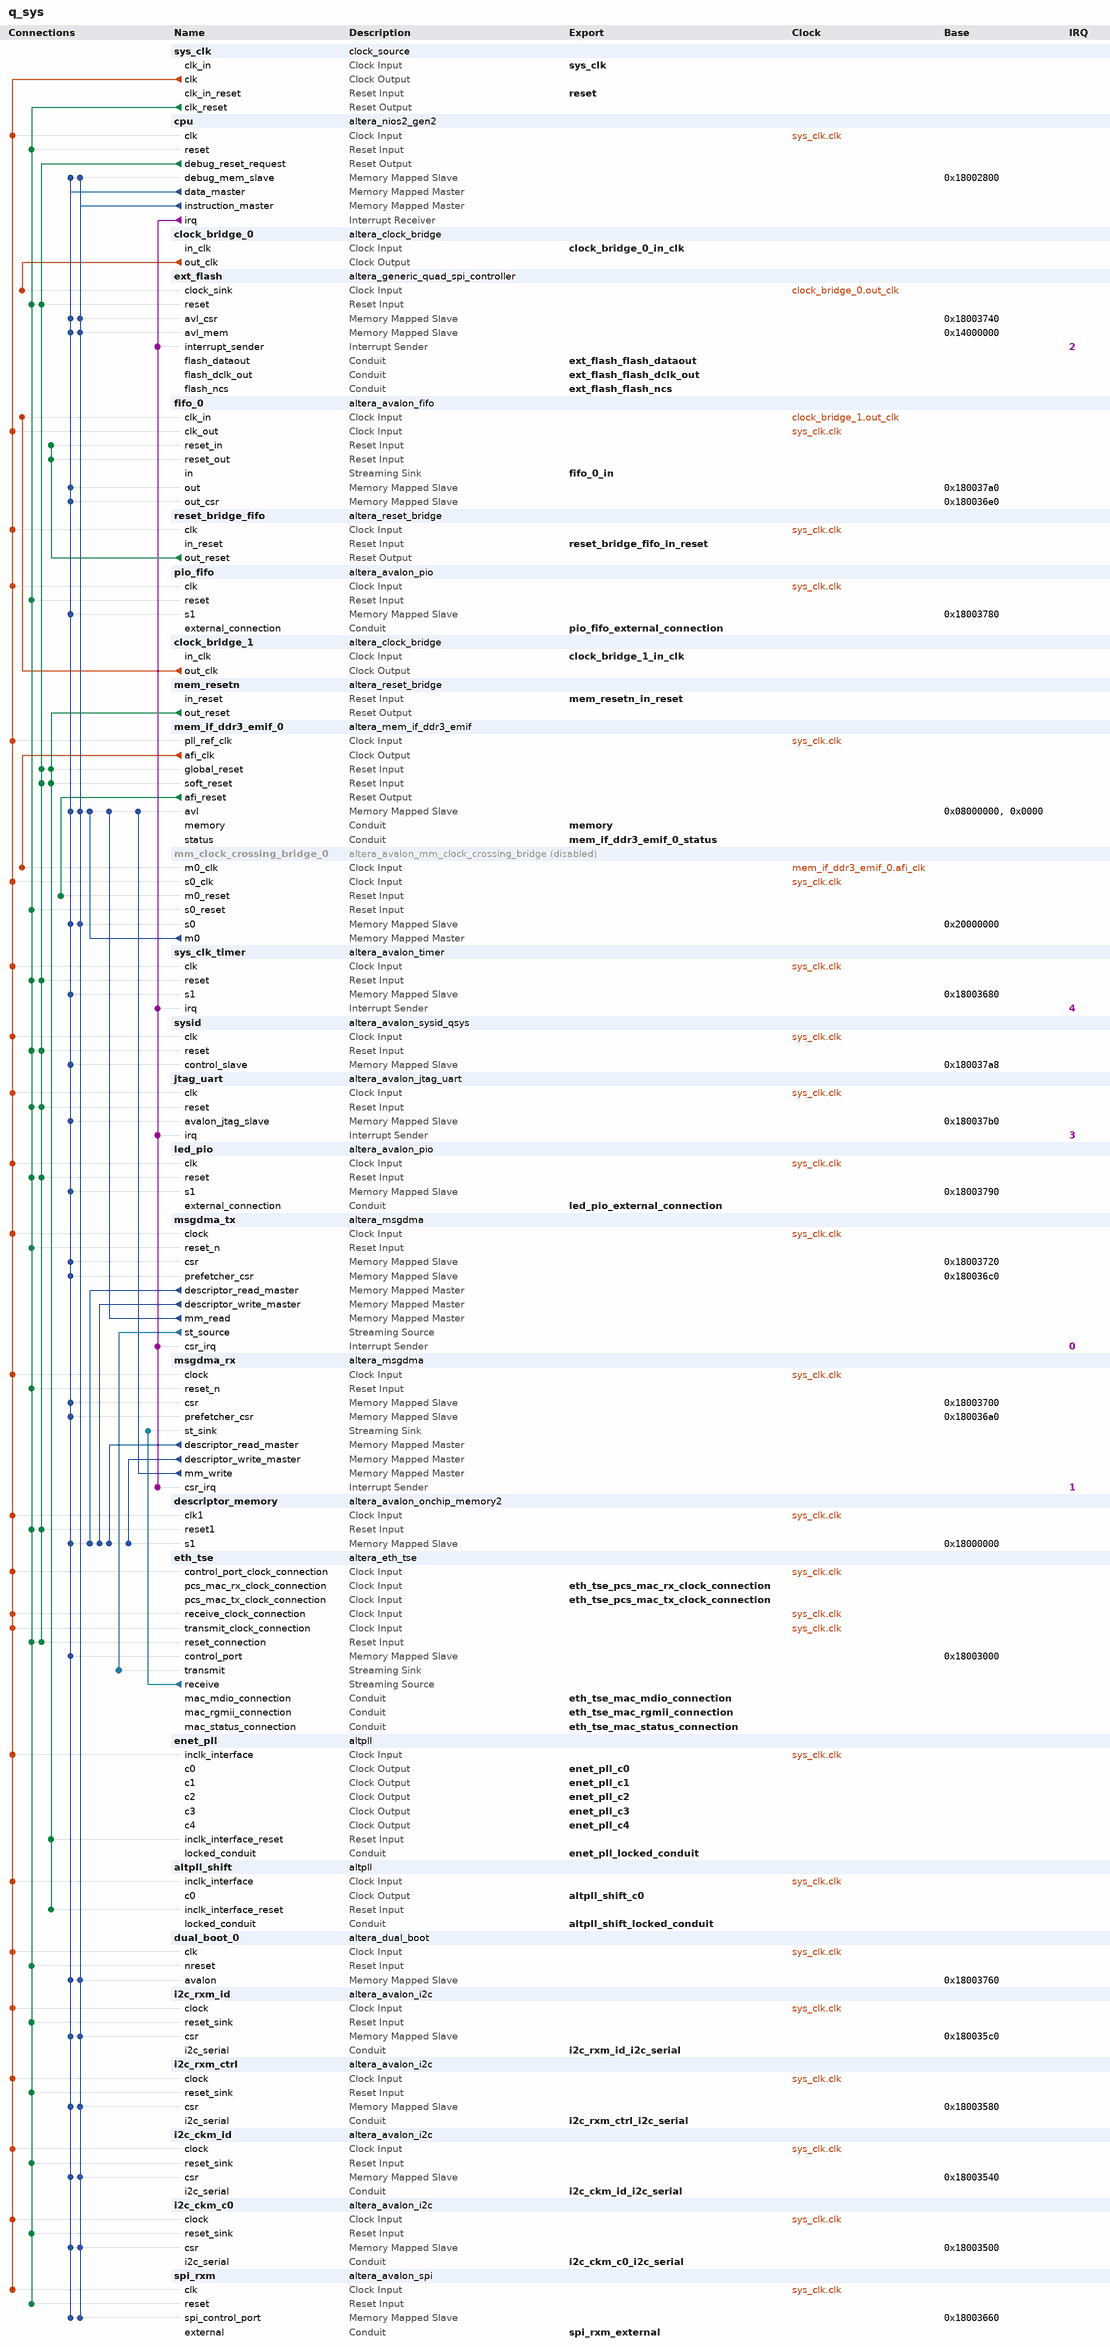
[diagram p0: system contents]
# Platform Designer (Qsys) system q_sys, MAX 10 10M50DAF484C6GES
# Parameters at their usual value, and those the tool derives, are not listed.
package require -exact qsys 20.1
create_system q_sys
set_project_property DEVICE_FAMILY {MAX 10}
set_project_property DEVICE 10M50DAF484C6GES

add_instance sys_clk clock_source 20.1
set_instance_parameter_value sys_clk clockFrequency 50000000

add_instance cpu altera_nios2_gen2 20.1
set_instance_parameter_value cpu dcache_size 0
set_instance_parameter_value cpu exceptionOffset 288
set_instance_parameter_value cpu exceptionSlave mem_if_ddr3_emif_0.avl
set_instance_parameter_value cpu icache_size 0
set_instance_parameter_value cpu impl Fast
set_instance_parameter_value cpu mul_32_impl 3
set_instance_parameter_value cpu resetOffset 4390912
set_instance_parameter_value cpu resetSlave ext_flash.avl_mem
set_instance_parameter_value cpu setting_activateTrace true
set_instance_parameter_value cpu shift_rot_impl 0

add_instance clock_bridge_0 altera_clock_bridge 20.1
set_instance_parameter_value clock_bridge_0 DERIVED_CLOCK_RATE 0
set_instance_parameter_value clock_bridge_0 EXPLICIT_CLOCK_RATE 0

add_instance ext_flash altera_generic_quad_spi_controller 20.1
set_instance_parameter_value ext_flash CHIP_SELS 1
set_instance_parameter_value ext_flash FLASH_TYPE Micron512
set_instance_parameter_value ext_flash IO_MODE QUAD
set_instance_parameter_value ext_flash UNIQUE_ID {$${FILENAME}_ext_flash}
set_instance_parameter_value ext_flash clkFreq 0

add_instance fifo_0 altera_avalon_fifo 20.1
set_instance_parameter_value fifo_0 bitsPerSymbol 32
set_instance_parameter_value fifo_0 channelWidth 0
set_instance_parameter_value fifo_0 errorWidth 0
set_instance_parameter_value fifo_0 fifoDepth 8192
set_instance_parameter_value fifo_0 fifoInputInterfaceOptions AVALONST_SINK
set_instance_parameter_value fifo_0 fifoOutputInterfaceOptions AVALONMM_READ
set_instance_parameter_value fifo_0 singleClockMode false
set_instance_parameter_value fifo_0 symbolsPerBeat 1
set_instance_parameter_value fifo_0 useIRQ true
set_instance_parameter_value fifo_0 usePacket false
set_instance_parameter_value fifo_0 useReadControl true
set_instance_parameter_value fifo_0 useWriteControl false

add_instance reset_bridge_fifo altera_reset_bridge 20.1
set_instance_parameter_value reset_bridge_fifo ACTIVE_LOW_RESET 0
set_instance_parameter_value reset_bridge_fifo SYNCHRONOUS_EDGES deassert

add_instance pio_fifo altera_avalon_pio 20.1
set_instance_parameter_value pio_fifo direction Output
set_instance_parameter_value pio_fifo width 1

add_instance clock_bridge_1 altera_clock_bridge 20.1
set_instance_parameter_value clock_bridge_1 DERIVED_CLOCK_RATE 0
set_instance_parameter_value clock_bridge_1 EXPLICIT_CLOCK_RATE 0

add_instance mem_resetn altera_reset_bridge 20.1
set_instance_parameter_value mem_resetn ACTIVE_LOW_RESET 1
set_instance_parameter_value mem_resetn SYNCHRONOUS_EDGES none

add_instance mem_if_ddr3_emif_0 altera_mem_if_ddr3_emif 20.1
set_instance_parameter_value mem_if_ddr3_emif_0 AVL_MAX_SIZE 4
set_instance_parameter_value mem_if_ddr3_emif_0 CALIBRATION_MODE Skip
set_instance_parameter_value mem_if_ddr3_emif_0 CPORT_TYPE_PORT Bidirectional,Bidirectional,Bidirectional,Bidirectional,Bidirectional,Bidirectional
set_instance_parameter_value mem_if_ddr3_emif_0 EXPORT_AFI_HALF_CLK false
set_instance_parameter_value mem_if_ddr3_emif_0 HARD_EMIF false
set_instance_parameter_value mem_if_ddr3_emif_0 MEM_BANKADDR_WIDTH 3
set_instance_parameter_value mem_if_ddr3_emif_0 MEM_CLK_FREQ 300.0
set_instance_parameter_value mem_if_ddr3_emif_0 MEM_CLK_FREQ_MAX 800.0
set_instance_parameter_value mem_if_ddr3_emif_0 MEM_COL_ADDR_WIDTH 10
set_instance_parameter_value mem_if_ddr3_emif_0 MEM_DQ_WIDTH 8
set_instance_parameter_value mem_if_ddr3_emif_0 MEM_DRV_STR RZQ/6
set_instance_parameter_value mem_if_ddr3_emif_0 MEM_FORMAT DISCRETE
set_instance_parameter_value mem_if_ddr3_emif_0 MEM_ROW_ADDR_WIDTH 14
set_instance_parameter_value mem_if_ddr3_emif_0 MEM_RTT_NOM {ODT Disabled}
set_instance_parameter_value mem_if_ddr3_emif_0 MEM_RTT_WR {Dynamic ODT off}
set_instance_parameter_value mem_if_ddr3_emif_0 MEM_TCL 5
set_instance_parameter_value mem_if_ddr3_emif_0 MEM_TFAW_NS 30.0
set_instance_parameter_value mem_if_ddr3_emif_0 MEM_TRAS_NS 35.0
set_instance_parameter_value mem_if_ddr3_emif_0 MEM_TRCD_NS 13.75
set_instance_parameter_value mem_if_ddr3_emif_0 MEM_TRFC_NS 110.0
set_instance_parameter_value mem_if_ddr3_emif_0 MEM_TRP_NS 13.75
set_instance_parameter_value mem_if_ddr3_emif_0 MEM_TRRD_NS 6.0
set_instance_parameter_value mem_if_ddr3_emif_0 MEM_TRTP_NS 7.5
set_instance_parameter_value mem_if_ddr3_emif_0 MEM_TWTR 6
set_instance_parameter_value mem_if_ddr3_emif_0 MEM_VENDOR JEDEC
set_instance_parameter_value mem_if_ddr3_emif_0 MEM_WTCL 5
set_instance_parameter_value mem_if_ddr3_emif_0 PLL_LOCATION Top_Bottom
set_instance_parameter_value mem_if_ddr3_emif_0 POWER_OF_TWO_BUS false
set_instance_parameter_value mem_if_ddr3_emif_0 PRIORITY_PORT 1,1,1,1,1,1
set_instance_parameter_value mem_if_ddr3_emif_0 RATE Half
set_instance_parameter_value mem_if_ddr3_emif_0 REF_CLK_FREQ 50.0
set_instance_parameter_value mem_if_ddr3_emif_0 SPEED_GRADE 6
set_instance_parameter_value mem_if_ddr3_emif_0 TIMING_BOARD_AC_SKEW 0.07801
set_instance_parameter_value mem_if_ddr3_emif_0 TIMING_BOARD_AC_TO_CK_SKEW -0.04709
set_instance_parameter_value mem_if_ddr3_emif_0 TIMING_BOARD_DQ_TO_DQS_SKEW -0.01152
set_instance_parameter_value mem_if_ddr3_emif_0 TIMING_BOARD_MAX_CK_DELAY 0.2443
set_instance_parameter_value mem_if_ddr3_emif_0 TIMING_BOARD_MAX_DQS_DELAY 0.21929
set_instance_parameter_value mem_if_ddr3_emif_0 TIMING_BOARD_SKEW_BETWEEN_DQS 0.04246
set_instance_parameter_value mem_if_ddr3_emif_0 TIMING_BOARD_SKEW_CKDQS_DIMM_MAX 0.04429
set_instance_parameter_value mem_if_ddr3_emif_0 TIMING_BOARD_SKEW_CKDQS_DIMM_MIN 0.02286
set_instance_parameter_value mem_if_ddr3_emif_0 TIMING_BOARD_SKEW_WITHIN_DQS 0.01806
set_instance_parameter_value mem_if_ddr3_emif_0 TIMING_TDH 45
set_instance_parameter_value mem_if_ddr3_emif_0 TIMING_TDQSCK 225
set_instance_parameter_value mem_if_ddr3_emif_0 TIMING_TDQSQ 100
set_instance_parameter_value mem_if_ddr3_emif_0 TIMING_TDQSS 0.27
set_instance_parameter_value mem_if_ddr3_emif_0 TIMING_TDS 10
set_instance_parameter_value mem_if_ddr3_emif_0 TIMING_TDSH 0.18
set_instance_parameter_value mem_if_ddr3_emif_0 TIMING_TDSS 0.18
set_instance_parameter_value mem_if_ddr3_emif_0 TIMING_TIH 120
set_instance_parameter_value mem_if_ddr3_emif_0 TIMING_TIS 170
set_instance_parameter_value mem_if_ddr3_emif_0 TIMING_TQSH 0.4
set_instance_parameter_value mem_if_ddr3_emif_0 USER_DEBUG_LEVEL 1

add_instance mm_clock_crossing_bridge_0 altera_avalon_mm_clock_crossing_bridge 20.1
set_instance_property mm_clock_crossing_bridge_0 ENABLED false
set_instance_parameter_value mm_clock_crossing_bridge_0 ADDRESS_WIDTH 27
set_instance_parameter_value mm_clock_crossing_bridge_0 COMMAND_FIFO_DEPTH 4
set_instance_parameter_value mm_clock_crossing_bridge_0 DATA_WIDTH 32
set_instance_parameter_value mm_clock_crossing_bridge_0 MASTER_SYNC_DEPTH 2
set_instance_parameter_value mm_clock_crossing_bridge_0 MAX_BURST_SIZE 1
set_instance_parameter_value mm_clock_crossing_bridge_0 RESPONSE_FIFO_DEPTH 4
set_instance_parameter_value mm_clock_crossing_bridge_0 SLAVE_SYNC_DEPTH 2
set_instance_parameter_value mm_clock_crossing_bridge_0 USE_AUTO_ADDRESS_WIDTH 0

add_instance sys_clk_timer altera_avalon_timer 20.1
set_instance_parameter_value sys_clk_timer period 10
set_instance_parameter_value sys_clk_timer periodUnits MSEC

add_instance sysid altera_avalon_sysid_qsys 20.1
set_instance_parameter_value sysid id -87110914

add_instance jtag_uart altera_avalon_jtag_uart 20.1
set_instance_parameter_value jtag_uart simInteractiveOptions INTERACTIVE_ASCII_OUTPUT

add_instance led_pio altera_avalon_pio 20.1
set_instance_parameter_value led_pio direction Output
set_instance_parameter_value led_pio resetValue 15
set_instance_parameter_value led_pio width 4

add_instance msgdma_tx altera_msgdma 20.1
set_instance_parameter_value msgdma_tx BURST_ENABLE 0
set_instance_parameter_value msgdma_tx DATA_FIFO_DEPTH 32
set_instance_parameter_value msgdma_tx DATA_WIDTH 32
set_instance_parameter_value msgdma_tx DESCRIPTOR_FIFO_DEPTH 128
set_instance_parameter_value msgdma_tx ENHANCED_FEATURES 0
set_instance_parameter_value msgdma_tx ERROR_ENABLE 1
set_instance_parameter_value msgdma_tx MAX_BURST_COUNT 2
set_instance_parameter_value msgdma_tx MAX_BYTE 2048
set_instance_parameter_value msgdma_tx MODE 1
set_instance_parameter_value msgdma_tx PACKET_ENABLE 1
set_instance_parameter_value msgdma_tx PREFETCHER_ENABLE 1
set_instance_parameter_value msgdma_tx TRANSFER_TYPE {Aligned Accesses}

add_instance msgdma_rx altera_msgdma 20.1
set_instance_parameter_value msgdma_rx BURST_ENABLE 0
set_instance_parameter_value msgdma_rx DATA_FIFO_DEPTH 32
set_instance_parameter_value msgdma_rx DATA_WIDTH 32
set_instance_parameter_value msgdma_rx DESCRIPTOR_FIFO_DEPTH 128
set_instance_parameter_value msgdma_rx ENHANCED_FEATURES 0
set_instance_parameter_value msgdma_rx ERROR_ENABLE 1
set_instance_parameter_value msgdma_rx MAX_BURST_COUNT 2
set_instance_parameter_value msgdma_rx MAX_BYTE 2048
set_instance_parameter_value msgdma_rx MODE 2
set_instance_parameter_value msgdma_rx PACKET_ENABLE 1
set_instance_parameter_value msgdma_rx PREFETCHER_ENABLE 1
set_instance_parameter_value msgdma_rx TRANSFER_TYPE {Aligned Accesses}

add_instance descriptor_memory altera_avalon_onchip_memory2 20.1
set_instance_parameter_value descriptor_memory dataWidth 32
set_instance_parameter_value descriptor_memory dualPort false
set_instance_parameter_value descriptor_memory initMemContent true
set_instance_parameter_value descriptor_memory initializationFileName /home/tom/Eth-TSDR-03/devkit_simple_socket_server-17_project/q_sys_descriptor_memory.hex
set_instance_parameter_value descriptor_memory memorySize 8192

add_instance eth_tse altera_eth_tse 20.1
set_instance_parameter_value eth_tse XCVR_RCFG_JTAG_ENABLE 0
set_instance_parameter_value eth_tse XCVR_SET_CAPABILITY_REG_ENABLE 0
set_instance_parameter_value eth_tse XCVR_SET_CSR_SOFT_LOGIC_ENABLE 0
set_instance_parameter_value eth_tse XCVR_SET_PRBS_SOFT_LOGIC_ENABLE 0
set_instance_parameter_value eth_tse XCVR_SET_USER_IDENTIFIER 0
set_instance_parameter_value eth_tse core_variation MAC_ONLY
set_instance_parameter_value eth_tse enable_hd_logic false
set_instance_parameter_value eth_tse enable_mac_flow_ctrl false
set_instance_parameter_value eth_tse enable_magic_detect true
set_instance_parameter_value eth_tse enable_sgmii true
set_instance_parameter_value eth_tse enable_shift16 true
set_instance_parameter_value eth_tse ifGMII RGMII
set_instance_parameter_value eth_tse ing_addr 11
set_instance_parameter_value eth_tse mdio_clk_div 40
set_instance_parameter_value eth_tse nf_phyip_rcfg_enable true
set_instance_parameter_value eth_tse stat_cnt_ena true
set_instance_parameter_value eth_tse transceiver_type NONE

add_instance enet_pll altpll 20.1
set_instance_parameter_value enet_pll CLK0_DIVIDE_BY 2
set_instance_parameter_value enet_pll CLK0_MULTIPLY_BY 5
set_instance_parameter_value enet_pll CLK1_DIVIDE_BY 2
set_instance_parameter_value enet_pll CLK1_DUTY_CYCLE 50
set_instance_parameter_value enet_pll CLK1_MULTIPLY_BY 1
set_instance_parameter_value enet_pll CLK1_PHASE_SHIFT 0
set_instance_parameter_value enet_pll CLK2_DIVIDE_BY 20
set_instance_parameter_value enet_pll CLK2_DUTY_CYCLE 50
set_instance_parameter_value enet_pll CLK2_MULTIPLY_BY 1
set_instance_parameter_value enet_pll CLK2_PHASE_SHIFT 0
set_instance_parameter_value enet_pll CLK3_DIVIDE_BY 2
set_instance_parameter_value enet_pll CLK3_DUTY_CYCLE 50
set_instance_parameter_value enet_pll CLK3_MULTIPLY_BY 5
set_instance_parameter_value enet_pll CLK3_PHASE_SHIFT -3000
set_instance_parameter_value enet_pll CLK4_DIVIDE_BY 2
set_instance_parameter_value enet_pll CLK4_DUTY_CYCLE 50
set_instance_parameter_value enet_pll CLK4_MULTIPLY_BY 1
set_instance_parameter_value enet_pll CLK4_PHASE_SHIFT -10000
set_instance_parameter_value enet_pll INCLK0_INPUT_FREQUENCY 20000
set_instance_parameter_value enet_pll OPERATION_MODE NO_COMPENSATION
set_instance_parameter_value enet_pll PORT_ARESET PORT_UNUSED
set_instance_parameter_value enet_pll PORT_LOCKED PORT_USED
set_instance_parameter_value enet_pll PORT_clk1 PORT_USED
set_instance_parameter_value enet_pll PORT_clk2 PORT_USED
set_instance_parameter_value enet_pll PORT_clk3 PORT_USED
set_instance_parameter_value enet_pll PORT_clk4 PORT_USED

add_instance altpll_shift altpll 20.1
set_instance_parameter_value altpll_shift CLK0_DIVIDE_BY 1
set_instance_parameter_value altpll_shift CLK0_MULTIPLY_BY 5
set_instance_parameter_value altpll_shift CLK1_DIVIDE_BY 2
set_instance_parameter_value altpll_shift CLK1_DUTY_CYCLE 50
set_instance_parameter_value altpll_shift CLK1_MULTIPLY_BY 1
set_instance_parameter_value altpll_shift CLK1_PHASE_SHIFT 15000
set_instance_parameter_value altpll_shift CLK2_DIVIDE_BY 20
set_instance_parameter_value altpll_shift CLK2_DUTY_CYCLE 50
set_instance_parameter_value altpll_shift CLK2_MULTIPLY_BY 1
set_instance_parameter_value altpll_shift CLK2_PHASE_SHIFT 0
set_instance_parameter_value altpll_shift INCLK0_INPUT_FREQUENCY 20000
set_instance_parameter_value altpll_shift PORT_ARESET PORT_USED
set_instance_parameter_value altpll_shift PORT_LOCKED PORT_USED
set_instance_parameter_value altpll_shift PORT_clk1 PORT_UNUSED
set_instance_parameter_value altpll_shift PORT_clk2 PORT_UNUSED
set_instance_parameter_value altpll_shift PORT_clk3 PORT_UNUSED

add_instance dual_boot_0 altera_dual_boot 20.1
set_instance_parameter_value dual_boot_0 CLOCK_FREQUENCY 50.0

add_instance i2c_rxm_id altera_avalon_i2c 20.1
set_instance_parameter_value i2c_rxm_id FIFO_DEPTH 4

add_instance i2c_rxm_ctrl altera_avalon_i2c 20.1
set_instance_parameter_value i2c_rxm_ctrl FIFO_DEPTH 4

add_instance i2c_ckm_id altera_avalon_i2c 20.1
set_instance_parameter_value i2c_ckm_id FIFO_DEPTH 4

add_instance i2c_ckm_c0 altera_avalon_i2c 20.1
set_instance_parameter_value i2c_ckm_c0 FIFO_DEPTH 4

add_instance spi_rxm altera_avalon_spi 20.1
set_instance_parameter_value spi_rxm clockPolarity 0
set_instance_parameter_value spi_rxm dataWidth 8
set_instance_parameter_value spi_rxm masterSPI true
set_instance_parameter_value spi_rxm numberOfSlaves 1
set_instance_parameter_value spi_rxm targetClockRate 6250000

# connections
add_connection clock_bridge_0.out_clk ext_flash.clock_sink clock
add_connection clock_bridge_1.out_clk fifo_0.clk_in clock
add_connection mem_if_ddr3_emif_0.afi_clk mm_clock_crossing_bridge_0.m0_clk clock
add_connection sys_clk.clk altpll_shift.inclk_interface clock
add_connection sys_clk.clk cpu.clk clock
add_connection sys_clk.clk descriptor_memory.clk1 clock
add_connection sys_clk.clk dual_boot_0.clk clock
add_connection sys_clk.clk enet_pll.inclk_interface clock
add_connection sys_clk.clk eth_tse.control_port_clock_connection clock
add_connection sys_clk.clk eth_tse.receive_clock_connection clock
add_connection sys_clk.clk eth_tse.transmit_clock_connection clock
add_connection sys_clk.clk fifo_0.clk_out clock
add_connection sys_clk.clk i2c_ckm_c0.clock clock
add_connection sys_clk.clk i2c_ckm_id.clock clock
add_connection sys_clk.clk i2c_rxm_ctrl.clock clock
add_connection sys_clk.clk i2c_rxm_id.clock clock
add_connection sys_clk.clk jtag_uart.clk clock
add_connection sys_clk.clk led_pio.clk clock
add_connection sys_clk.clk mem_if_ddr3_emif_0.pll_ref_clk clock
add_connection sys_clk.clk mm_clock_crossing_bridge_0.s0_clk clock
add_connection sys_clk.clk msgdma_rx.clock clock
add_connection sys_clk.clk msgdma_tx.clock clock
add_connection sys_clk.clk pio_fifo.clk clock
add_connection sys_clk.clk reset_bridge_fifo.clk clock
add_connection sys_clk.clk spi_rxm.clk clock
add_connection sys_clk.clk sys_clk_timer.clk clock
add_connection sys_clk.clk sysid.clk clock
add_connection cpu.debug_reset_request descriptor_memory.reset1 reset
add_connection cpu.debug_reset_request eth_tse.reset_connection reset
add_connection cpu.debug_reset_request ext_flash.reset reset
add_connection cpu.debug_reset_request jtag_uart.reset reset
add_connection cpu.debug_reset_request led_pio.reset reset
add_connection cpu.debug_reset_request mem_if_ddr3_emif_0.global_reset reset
add_connection cpu.debug_reset_request mem_if_ddr3_emif_0.soft_reset reset
add_connection cpu.debug_reset_request sys_clk_timer.reset reset
add_connection cpu.debug_reset_request sysid.reset reset
add_connection mem_if_ddr3_emif_0.afi_reset mm_clock_crossing_bridge_0.m0_reset reset
add_connection mem_resetn.out_reset altpll_shift.inclk_interface_reset reset
add_connection mem_resetn.out_reset enet_pll.inclk_interface_reset reset
add_connection mem_resetn.out_reset mem_if_ddr3_emif_0.global_reset reset
add_connection mem_resetn.out_reset mem_if_ddr3_emif_0.soft_reset reset
add_connection reset_bridge_fifo.out_reset fifo_0.reset_in reset
add_connection reset_bridge_fifo.out_reset fifo_0.reset_out reset
add_connection sys_clk.clk_reset cpu.reset reset
add_connection sys_clk.clk_reset descriptor_memory.reset1 reset
add_connection sys_clk.clk_reset dual_boot_0.nreset reset
add_connection sys_clk.clk_reset eth_tse.reset_connection reset
add_connection sys_clk.clk_reset ext_flash.reset reset
add_connection sys_clk.clk_reset i2c_ckm_c0.reset_sink reset
add_connection sys_clk.clk_reset i2c_ckm_id.reset_sink reset
add_connection sys_clk.clk_reset i2c_rxm_ctrl.reset_sink reset
add_connection sys_clk.clk_reset i2c_rxm_id.reset_sink reset
add_connection sys_clk.clk_reset jtag_uart.reset reset
add_connection sys_clk.clk_reset led_pio.reset reset
add_connection sys_clk.clk_reset mm_clock_crossing_bridge_0.s0_reset reset
add_connection sys_clk.clk_reset msgdma_rx.reset_n reset
add_connection sys_clk.clk_reset msgdma_tx.reset_n reset
add_connection sys_clk.clk_reset pio_fifo.reset reset
add_connection sys_clk.clk_reset spi_rxm.reset reset
add_connection sys_clk.clk_reset sys_clk_timer.reset reset
add_connection sys_clk.clk_reset sysid.reset reset
add_connection cpu.data_master cpu.debug_mem_slave avalon
set_connection_parameter_value cpu.data_master/cpu.debug_mem_slave baseAddress 0x18002800
add_connection cpu.data_master descriptor_memory.s1 avalon
set_connection_parameter_value cpu.data_master/descriptor_memory.s1 baseAddress 0x18000000
add_connection cpu.data_master dual_boot_0.avalon avalon
set_connection_parameter_value cpu.data_master/dual_boot_0.avalon baseAddress 0x18003760
add_connection cpu.data_master eth_tse.control_port avalon
set_connection_parameter_value cpu.data_master/eth_tse.control_port baseAddress 0x18003000
add_connection cpu.data_master ext_flash.avl_csr avalon
set_connection_parameter_value cpu.data_master/ext_flash.avl_csr baseAddress 0x18003740
add_connection cpu.data_master ext_flash.avl_mem avalon
set_connection_parameter_value cpu.data_master/ext_flash.avl_mem baseAddress 0x14000000
add_connection cpu.data_master fifo_0.out avalon
set_connection_parameter_value cpu.data_master/fifo_0.out baseAddress 0x180037a0
add_connection cpu.data_master fifo_0.out_csr avalon
set_connection_parameter_value cpu.data_master/fifo_0.out_csr baseAddress 0x180036e0
add_connection cpu.data_master i2c_ckm_c0.csr avalon
set_connection_parameter_value cpu.data_master/i2c_ckm_c0.csr baseAddress 0x18003500
add_connection cpu.data_master i2c_ckm_id.csr avalon
set_connection_parameter_value cpu.data_master/i2c_ckm_id.csr baseAddress 0x18003540
add_connection cpu.data_master i2c_rxm_ctrl.csr avalon
set_connection_parameter_value cpu.data_master/i2c_rxm_ctrl.csr baseAddress 0x18003580
add_connection cpu.data_master i2c_rxm_id.csr avalon
set_connection_parameter_value cpu.data_master/i2c_rxm_id.csr baseAddress 0x180035c0
add_connection cpu.data_master jtag_uart.avalon_jtag_slave avalon
set_connection_parameter_value cpu.data_master/jtag_uart.avalon_jtag_slave baseAddress 0x180037b0
add_connection cpu.data_master led_pio.s1 avalon
set_connection_parameter_value cpu.data_master/led_pio.s1 baseAddress 0x18003790
add_connection cpu.data_master mem_if_ddr3_emif_0.avl avalon
set_connection_parameter_value cpu.data_master/mem_if_ddr3_emif_0.avl baseAddress 0x08000000
add_connection cpu.data_master mm_clock_crossing_bridge_0.s0 avalon
set_connection_parameter_value cpu.data_master/mm_clock_crossing_bridge_0.s0 baseAddress 0x20000000
add_connection cpu.data_master msgdma_rx.csr avalon
set_connection_parameter_value cpu.data_master/msgdma_rx.csr baseAddress 0x18003700
add_connection cpu.data_master msgdma_rx.prefetcher_csr avalon
set_connection_parameter_value cpu.data_master/msgdma_rx.prefetcher_csr baseAddress 0x180036a0
add_connection cpu.data_master msgdma_tx.csr avalon
set_connection_parameter_value cpu.data_master/msgdma_tx.csr baseAddress 0x18003720
add_connection cpu.data_master msgdma_tx.prefetcher_csr avalon
set_connection_parameter_value cpu.data_master/msgdma_tx.prefetcher_csr baseAddress 0x180036c0
add_connection cpu.data_master pio_fifo.s1 avalon
set_connection_parameter_value cpu.data_master/pio_fifo.s1 baseAddress 0x18003780
add_connection cpu.data_master spi_rxm.spi_control_port avalon
set_connection_parameter_value cpu.data_master/spi_rxm.spi_control_port baseAddress 0x18003660
add_connection cpu.data_master sys_clk_timer.s1 avalon
set_connection_parameter_value cpu.data_master/sys_clk_timer.s1 baseAddress 0x18003680
add_connection cpu.data_master sysid.control_slave avalon
set_connection_parameter_value cpu.data_master/sysid.control_slave baseAddress 0x180037a8
add_connection cpu.instruction_master cpu.debug_mem_slave avalon
set_connection_parameter_value cpu.instruction_master/cpu.debug_mem_slave baseAddress 0x18002800
add_connection cpu.instruction_master dual_boot_0.avalon avalon
set_connection_parameter_value cpu.instruction_master/dual_boot_0.avalon baseAddress 0x18003760
add_connection cpu.instruction_master ext_flash.avl_csr avalon
set_connection_parameter_value cpu.instruction_master/ext_flash.avl_csr baseAddress 0x18003740
add_connection cpu.instruction_master ext_flash.avl_mem avalon
set_connection_parameter_value cpu.instruction_master/ext_flash.avl_mem baseAddress 0x14000000
add_connection cpu.instruction_master i2c_ckm_c0.csr avalon
set_connection_parameter_value cpu.instruction_master/i2c_ckm_c0.csr baseAddress 0x18003500
add_connection cpu.instruction_master i2c_ckm_id.csr avalon
set_connection_parameter_value cpu.instruction_master/i2c_ckm_id.csr baseAddress 0x18003540
add_connection cpu.instruction_master i2c_rxm_ctrl.csr avalon
set_connection_parameter_value cpu.instruction_master/i2c_rxm_ctrl.csr baseAddress 0x18003580
add_connection cpu.instruction_master i2c_rxm_id.csr avalon
set_connection_parameter_value cpu.instruction_master/i2c_rxm_id.csr baseAddress 0x180035c0
add_connection cpu.instruction_master mem_if_ddr3_emif_0.avl avalon
set_connection_parameter_value cpu.instruction_master/mem_if_ddr3_emif_0.avl baseAddress 0x08000000
add_connection cpu.instruction_master mm_clock_crossing_bridge_0.s0 avalon
set_connection_parameter_value cpu.instruction_master/mm_clock_crossing_bridge_0.s0 baseAddress 0x20000000
add_connection cpu.instruction_master spi_rxm.spi_control_port avalon
set_connection_parameter_value cpu.instruction_master/spi_rxm.spi_control_port baseAddress 0x18003660
add_connection mm_clock_crossing_bridge_0.m0 mem_if_ddr3_emif_0.avl avalon
set_connection_parameter_value mm_clock_crossing_bridge_0.m0/mem_if_ddr3_emif_0.avl baseAddress 0x0000
add_connection msgdma_rx.descriptor_read_master descriptor_memory.s1 avalon
set_connection_parameter_value msgdma_rx.descriptor_read_master/descriptor_memory.s1 baseAddress 0x18000000
add_connection msgdma_rx.descriptor_write_master descriptor_memory.s1 avalon
set_connection_parameter_value msgdma_rx.descriptor_write_master/descriptor_memory.s1 baseAddress 0x18000000
add_connection msgdma_rx.mm_write mem_if_ddr3_emif_0.avl avalon
set_connection_parameter_value msgdma_rx.mm_write/mem_if_ddr3_emif_0.avl baseAddress 0x08000000
add_connection msgdma_tx.descriptor_read_master descriptor_memory.s1 avalon
set_connection_parameter_value msgdma_tx.descriptor_read_master/descriptor_memory.s1 baseAddress 0x18000000
add_connection msgdma_tx.descriptor_write_master descriptor_memory.s1 avalon
set_connection_parameter_value msgdma_tx.descriptor_write_master/descriptor_memory.s1 baseAddress 0x18000000
add_connection msgdma_tx.mm_read mem_if_ddr3_emif_0.avl avalon
set_connection_parameter_value msgdma_tx.mm_read/mem_if_ddr3_emif_0.avl baseAddress 0x08000000
add_connection eth_tse.receive msgdma_rx.st_sink avalon_streaming
add_connection msgdma_tx.st_source eth_tse.transmit avalon_streaming
add_connection cpu.irq ext_flash.interrupt_sender interrupt
set_connection_parameter_value cpu.irq/ext_flash.interrupt_sender irqNumber 2
add_connection cpu.irq jtag_uart.irq interrupt
set_connection_parameter_value cpu.irq/jtag_uart.irq irqNumber 3
add_connection cpu.irq msgdma_rx.csr_irq interrupt
set_connection_parameter_value cpu.irq/msgdma_rx.csr_irq irqNumber 1
add_connection cpu.irq msgdma_tx.csr_irq interrupt
set_connection_parameter_value cpu.irq/msgdma_tx.csr_irq irqNumber 0
add_connection cpu.irq sys_clk_timer.irq interrupt
set_connection_parameter_value cpu.irq/sys_clk_timer.irq irqNumber 4

# exported interfaces
add_interface altpll_shift_c0 clock source
set_interface_property altpll_shift_c0 EXPORT_OF altpll_shift.c0
add_interface altpll_shift_locked_conduit conduit end
set_interface_property altpll_shift_locked_conduit EXPORT_OF altpll_shift.locked_conduit
add_interface clock_bridge_0_in_clk clock sink
set_interface_property clock_bridge_0_in_clk EXPORT_OF clock_bridge_0.in_clk
add_interface clock_bridge_1_in_clk clock sink
set_interface_property clock_bridge_1_in_clk EXPORT_OF clock_bridge_1.in_clk
add_interface enet_pll_c0 clock source
set_interface_property enet_pll_c0 EXPORT_OF enet_pll.c0
add_interface enet_pll_c1 clock source
set_interface_property enet_pll_c1 EXPORT_OF enet_pll.c1
add_interface enet_pll_c2 clock source
set_interface_property enet_pll_c2 EXPORT_OF enet_pll.c2
add_interface enet_pll_c3 clock source
set_interface_property enet_pll_c3 EXPORT_OF enet_pll.c3
add_interface enet_pll_c4 clock source
set_interface_property enet_pll_c4 EXPORT_OF enet_pll.c4
add_interface enet_pll_locked_conduit conduit end
set_interface_property enet_pll_locked_conduit EXPORT_OF enet_pll.locked_conduit
add_interface eth_tse_mac_mdio_connection conduit end
set_interface_property eth_tse_mac_mdio_connection EXPORT_OF eth_tse.mac_mdio_connection
add_interface eth_tse_mac_rgmii_connection conduit end
set_interface_property eth_tse_mac_rgmii_connection EXPORT_OF eth_tse.mac_rgmii_connection
add_interface eth_tse_mac_status_connection conduit end
set_interface_property eth_tse_mac_status_connection EXPORT_OF eth_tse.mac_status_connection
add_interface eth_tse_pcs_mac_rx_clock_connection clock sink
set_interface_property eth_tse_pcs_mac_rx_clock_connection EXPORT_OF eth_tse.pcs_mac_rx_clock_connection
add_interface eth_tse_pcs_mac_tx_clock_connection clock sink
set_interface_property eth_tse_pcs_mac_tx_clock_connection EXPORT_OF eth_tse.pcs_mac_tx_clock_connection
add_interface ext_flash_flash_dataout conduit end
set_interface_property ext_flash_flash_dataout EXPORT_OF ext_flash.flash_dataout
add_interface ext_flash_flash_dclk_out conduit end
set_interface_property ext_flash_flash_dclk_out EXPORT_OF ext_flash.flash_dclk_out
add_interface ext_flash_flash_ncs conduit end
set_interface_property ext_flash_flash_ncs EXPORT_OF ext_flash.flash_ncs
add_interface fifo_0_in avalon_streaming sink
set_interface_property fifo_0_in EXPORT_OF fifo_0.in
add_interface i2c_ckm_c0_i2c_serial conduit end
set_interface_property i2c_ckm_c0_i2c_serial EXPORT_OF i2c_ckm_c0.i2c_serial
add_interface i2c_ckm_id_i2c_serial conduit end
set_interface_property i2c_ckm_id_i2c_serial EXPORT_OF i2c_ckm_id.i2c_serial
add_interface i2c_rxm_ctrl_i2c_serial conduit end
set_interface_property i2c_rxm_ctrl_i2c_serial EXPORT_OF i2c_rxm_ctrl.i2c_serial
add_interface i2c_rxm_id_i2c_serial conduit end
set_interface_property i2c_rxm_id_i2c_serial EXPORT_OF i2c_rxm_id.i2c_serial
add_interface led_pio_external_connection conduit end
set_interface_property led_pio_external_connection EXPORT_OF led_pio.external_connection
add_interface mem_if_ddr3_emif_0_status conduit end
set_interface_property mem_if_ddr3_emif_0_status EXPORT_OF mem_if_ddr3_emif_0.status
add_interface mem_resetn_in_reset reset sink
set_interface_property mem_resetn_in_reset EXPORT_OF mem_resetn.in_reset
add_interface memory conduit end
set_interface_property memory EXPORT_OF mem_if_ddr3_emif_0.memory
add_interface pio_fifo_external_connection conduit end
set_interface_property pio_fifo_external_connection EXPORT_OF pio_fifo.external_connection
add_interface reset reset sink
set_interface_property reset EXPORT_OF sys_clk.clk_in_reset
add_interface reset_bridge_fifo_in_reset reset sink
set_interface_property reset_bridge_fifo_in_reset EXPORT_OF reset_bridge_fifo.in_reset
add_interface spi_rxm_external conduit end
set_interface_property spi_rxm_external EXPORT_OF spi_rxm.external
add_interface sys_clk clock sink
set_interface_property sys_clk EXPORT_OF sys_clk.clk_in

set_interconnect_requirement {$system} qsys_mm.clockCrossingAdapter HANDSHAKE
set_interconnect_requirement {$system} qsys_mm.maxAdditionalLatency 0

save_system q_sys.qsys
